# Altium schematic sheet STM32核心系统.SchDoc
size A4
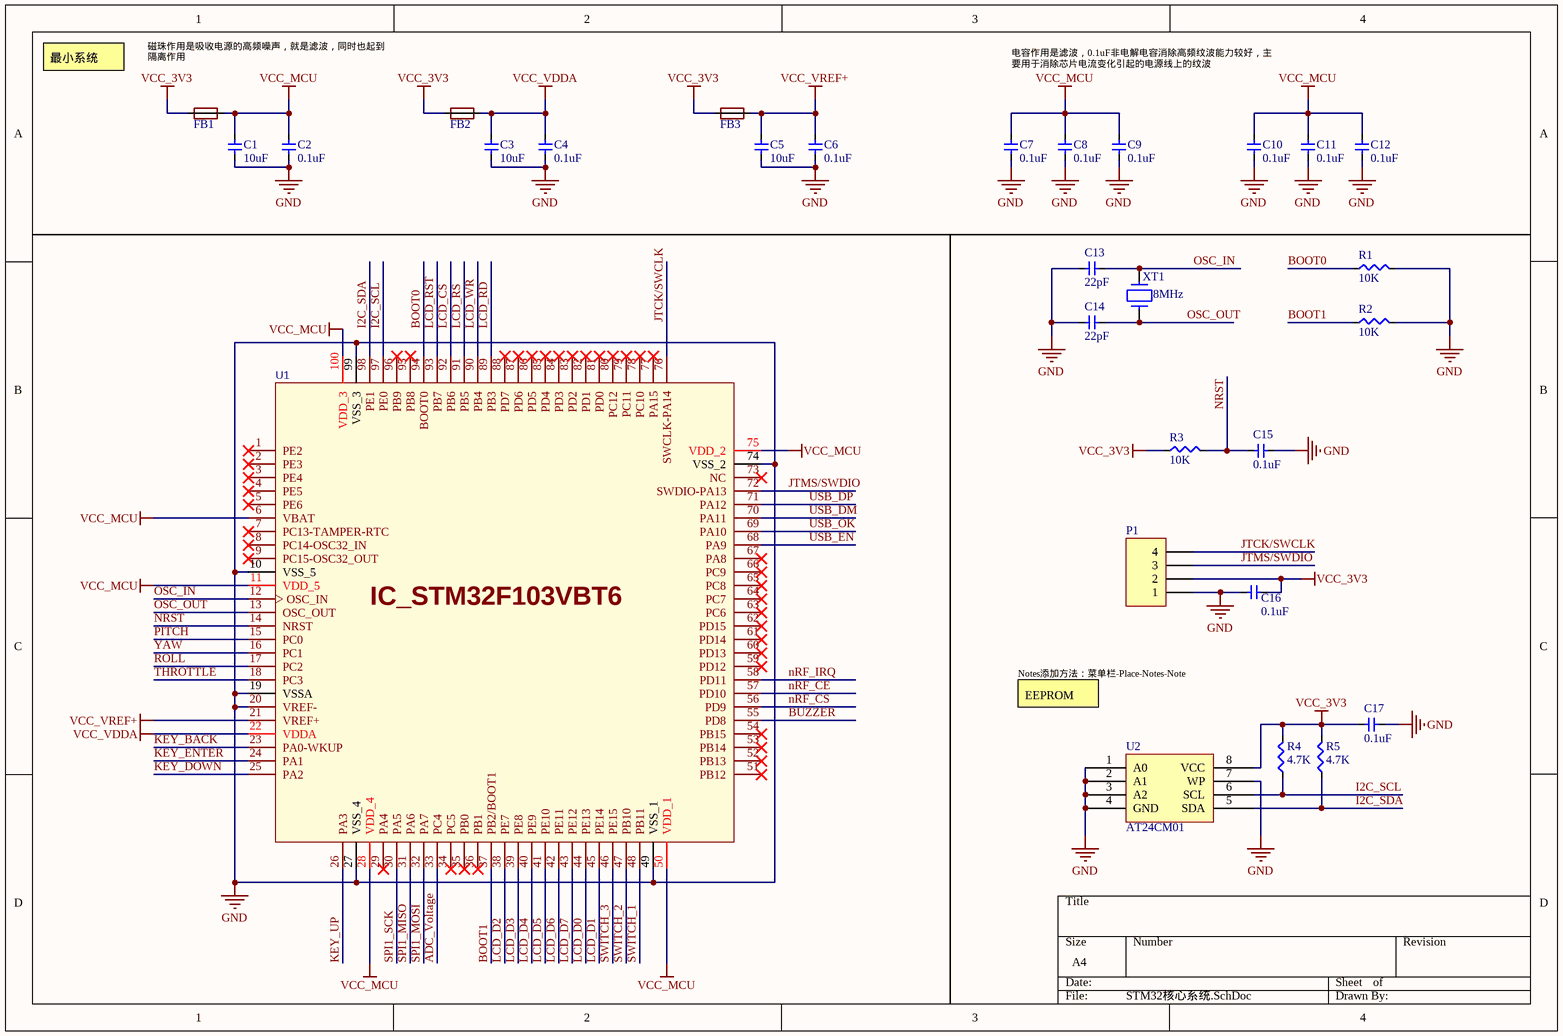
[diagram p0: STM32核心系统.SchDoc]

## Parts
C1  10uF  [C 0603_L]
C2  0.1uF  [C 0603_L]
C3  10uF  [C 0603_L]
C4  0.1uF  [C 0603_L]
C5  10uF  [C 0603_L]
C6  0.1uF  [C 0603_L]
C7  0.1uF  [C 0603_L]
C8  0.1uF  [C 0603_L]
C9  0.1uF  [C 0603_L]
C10  0.1uF  [C 0603_L]
C11  0.1uF  [C 0603_L]
C12  0.1uF  [C 0603_L]
C13  22pF  [C 0603_L]
C14  22pF  [C 0603_L]
C15  0.1uF  [C 0603_L]
C16  0.1uF  [C 0603_L]
C17  0.1uF  [C 0603_L]
FB1  FB_BEAD  [FB 0603_L]  (value not drawn)
FB2  FB_BEAD  [FB 0603_L]  (value not drawn)
FB3  FB_BEAD  [FB 0603_L]  (value not drawn)
P1  Header 4  [XH2.54-WI-4P]  (value not drawn)
R1  10K  [R 0603_L]
R2  10K  [R 0603_L]
R3  10K  [R 0603_L]
R4  4.7K  [R 0603_L]
R5  4.7K  [R 0603_L]
U1  IC_STM32F103VBT6  [LQFP100 14x14_M]
U2  AT24CM01  [SOIC-8]
XT1  value 8MHz  [OSC 5032-2P]  (hidden comment: XT_CRYSTAL2P)

## Nets
GND: C1.2 C2.2 C3.2 C4.2 C5.2 C6.2 C7.2 C8.2 C9.2 C10.2 C11.2 C12.2 C13.1 C14.1 C15.2 C16.1 C17.2 P1.1 R1.2 R2.2 U1.10(VSS_5) U1.19(VSSA) U1.20(VREF-) U1.27(VSS_4) U1.49(VSS_1) U1.74(VSS_2) U1.99(VSS_3) U2.1(A0) U2.2(A1) U2.3(A2) U2.4(GND) U2.7(WP)
VCC_3V3: C16.2 C17.1 FB1.2 FB2.2 FB3.2 P1.2 R3.1 R4.2 R5.2 U2.8(VCC)
VCC_MCU: C1.1 C2.1 C7.1 C8.1 C9.1 C10.1 C11.1 C12.1 FB1.1 U1.6(VBAT) U1.11(VDD_5) U1.28(VDD_4) U1.50(VDD_1) U1.75(VDD_2) U1.100(VDD_3)
VCC_VDDA: C3.1 C4.1 FB2.1 U1.22(VDDA)
VCC_VREF+: C5.1 C6.1 FB3.1 U1.21(VREF+)
ADC_Voltage: U1.33(PC4)
BOOT0: R1.1 U1.94(BOOT0)
BOOT1: R2.1 U1.37(PB2/BOOT1)
BUZZER: U1.55(PD8)
I2C_SCL: R4.1 U1.97(PE0) U2.6(SCL)
I2C_SDA: R5.1 U1.98(PE1) U2.5(SDA)
JTCK/SWCLK: P1.4 U1.76(SWCLK-PA14)
JTMS/SWDIO: P1.3 U1.72(SWDIO-PA13)
KEY_BACK: U1.23(PA0-WKUP)
KEY_DOWN: U1.25(PA2)
KEY_ENTER: U1.24(PA1)
KEY_UP: U1.26(PA3)
LCD_CS: U1.92(PB6)
LCD_D0: U1.44(PE13)
LCD_D1: U1.45(PE14)
LCD_D2: U1.38(PE7)
LCD_D3: U1.39(PE8)
LCD_D4: U1.40(PE9)
LCD_D5: U1.41(PE10)
LCD_D6: U1.42(PE11)
LCD_D7: U1.43(PE12)
LCD_RD: U1.89(PB3)
LCD_RS: U1.91(PB5)
LCD_RST: U1.93(PB7)
LCD_WR: U1.90(PB4)
nRF_CE: U1.57(PD10)
nRF_CS: U1.56(PD9)
nRF_IRQ: U1.58(PD11)
NRST: C15.1 R3.2 U1.14(NRST)
OSC_IN: C13.2 U1.12(OSC_IN) XT1.2
OSC_OUT: C14.2 U1.13(OSC_OUT) XT1.1
PITCH: U1.15(PC0)
ROLL: U1.17(PC2)
SPI1_MISO: U1.31(PA6)
SPI1_MOSI: U1.32(PA7)
SPI1_SCK: U1.30(PA5)
SWITCH_1: U1.48(PB11)
SWITCH_2: U1.47(PB10)
SWITCH_3: U1.46(PE15)
THROTTLE: U1.18(PC3)
USB_DM: U1.70(PA11)
USB_DP: U1.71(PA12)
USB_EN: U1.68(PA9)
USB_OK: U1.69(PA10)
YAW: U1.16(PC1)

Not connected (* = marked no-connect by the designer): U1 1(PE2)* 2(PE3)* 3(PE4)* 4(PE5)* 5(PE6)* 7(PC13-TAMPER-RTC)* 8(PC14-OSC32_IN)* 9(PC15-OSC32_OUT)* 29(PA4)* 34(PC5)* 35(PB0)* 36(PB1)* 51(PB12)* 52(PB13)* 53(PB14)* 54(PB15)* 59(PD12)* 60(PD13)* 61(PD14)* 62(PD15)* 63(PC6)* 64(PC7)* 65(PC8)* 66(PC9)* 67(PA8)* 73(NC)* 77(PA15)* 78(PC10)* 79(PC11)* 80(PC12)* 81(PD0)* 82(PD1)* 83(PD2)* 84(PD3)* 85(PD4)* 86(PD5)* 87(PD6)* 88(PD7)* 95(PB8)* 96(PB9)*

## Notes on the sheet
- 最小系统
- 磁珠作用是吸收电源的高频噪声，就是滤波，同时也起到隔离作用
- 电容作用是滤波，0.1uF非电解电容消除高频纹波能力较好，主要用于消除芯片电流变化引起的电源线上的纹波
- Notes添加方法：菜单栏-Place-Notes-Note
- EEPROM

## Library data of the parts
C1-C17 = CX_CAP: 电容
FB1-FB3 = FB_BEAD: 磁珠
P1 = Header 4: Header, 4-Pin; LatestRevisionDate: 17-Jul-2002; LatestRevisionNote: Re-released for DXP Platform.; Publisher: Altium Limited
R1-R5 = RX_RES: 电阻
U1 = IC_STM32F103VBT6: STM32单片机; BOM_Manufacturer: ST; subpart_no: 2; tags: STM32; BOM_Supplier Part: C8314; BOM_Supplier: LCSC; BOM_Manufacturer Part: STM32F103VBT6; image: http://image.lceda.cn/szlcsc/C8314.jpg; spicePre: U
U2 = IC_AT24C02: 存储芯片
XT1 = XT_CRYSTAL2P: 2P晶振